# EasyEDA schematic 1-Schematic_first pcb.json
TITLE: Sheet_1; REV: 1.0; Date: 2023-10-01; Sheet: 1/1; Drawn By: Muhammad Hamza; Company: Your Company
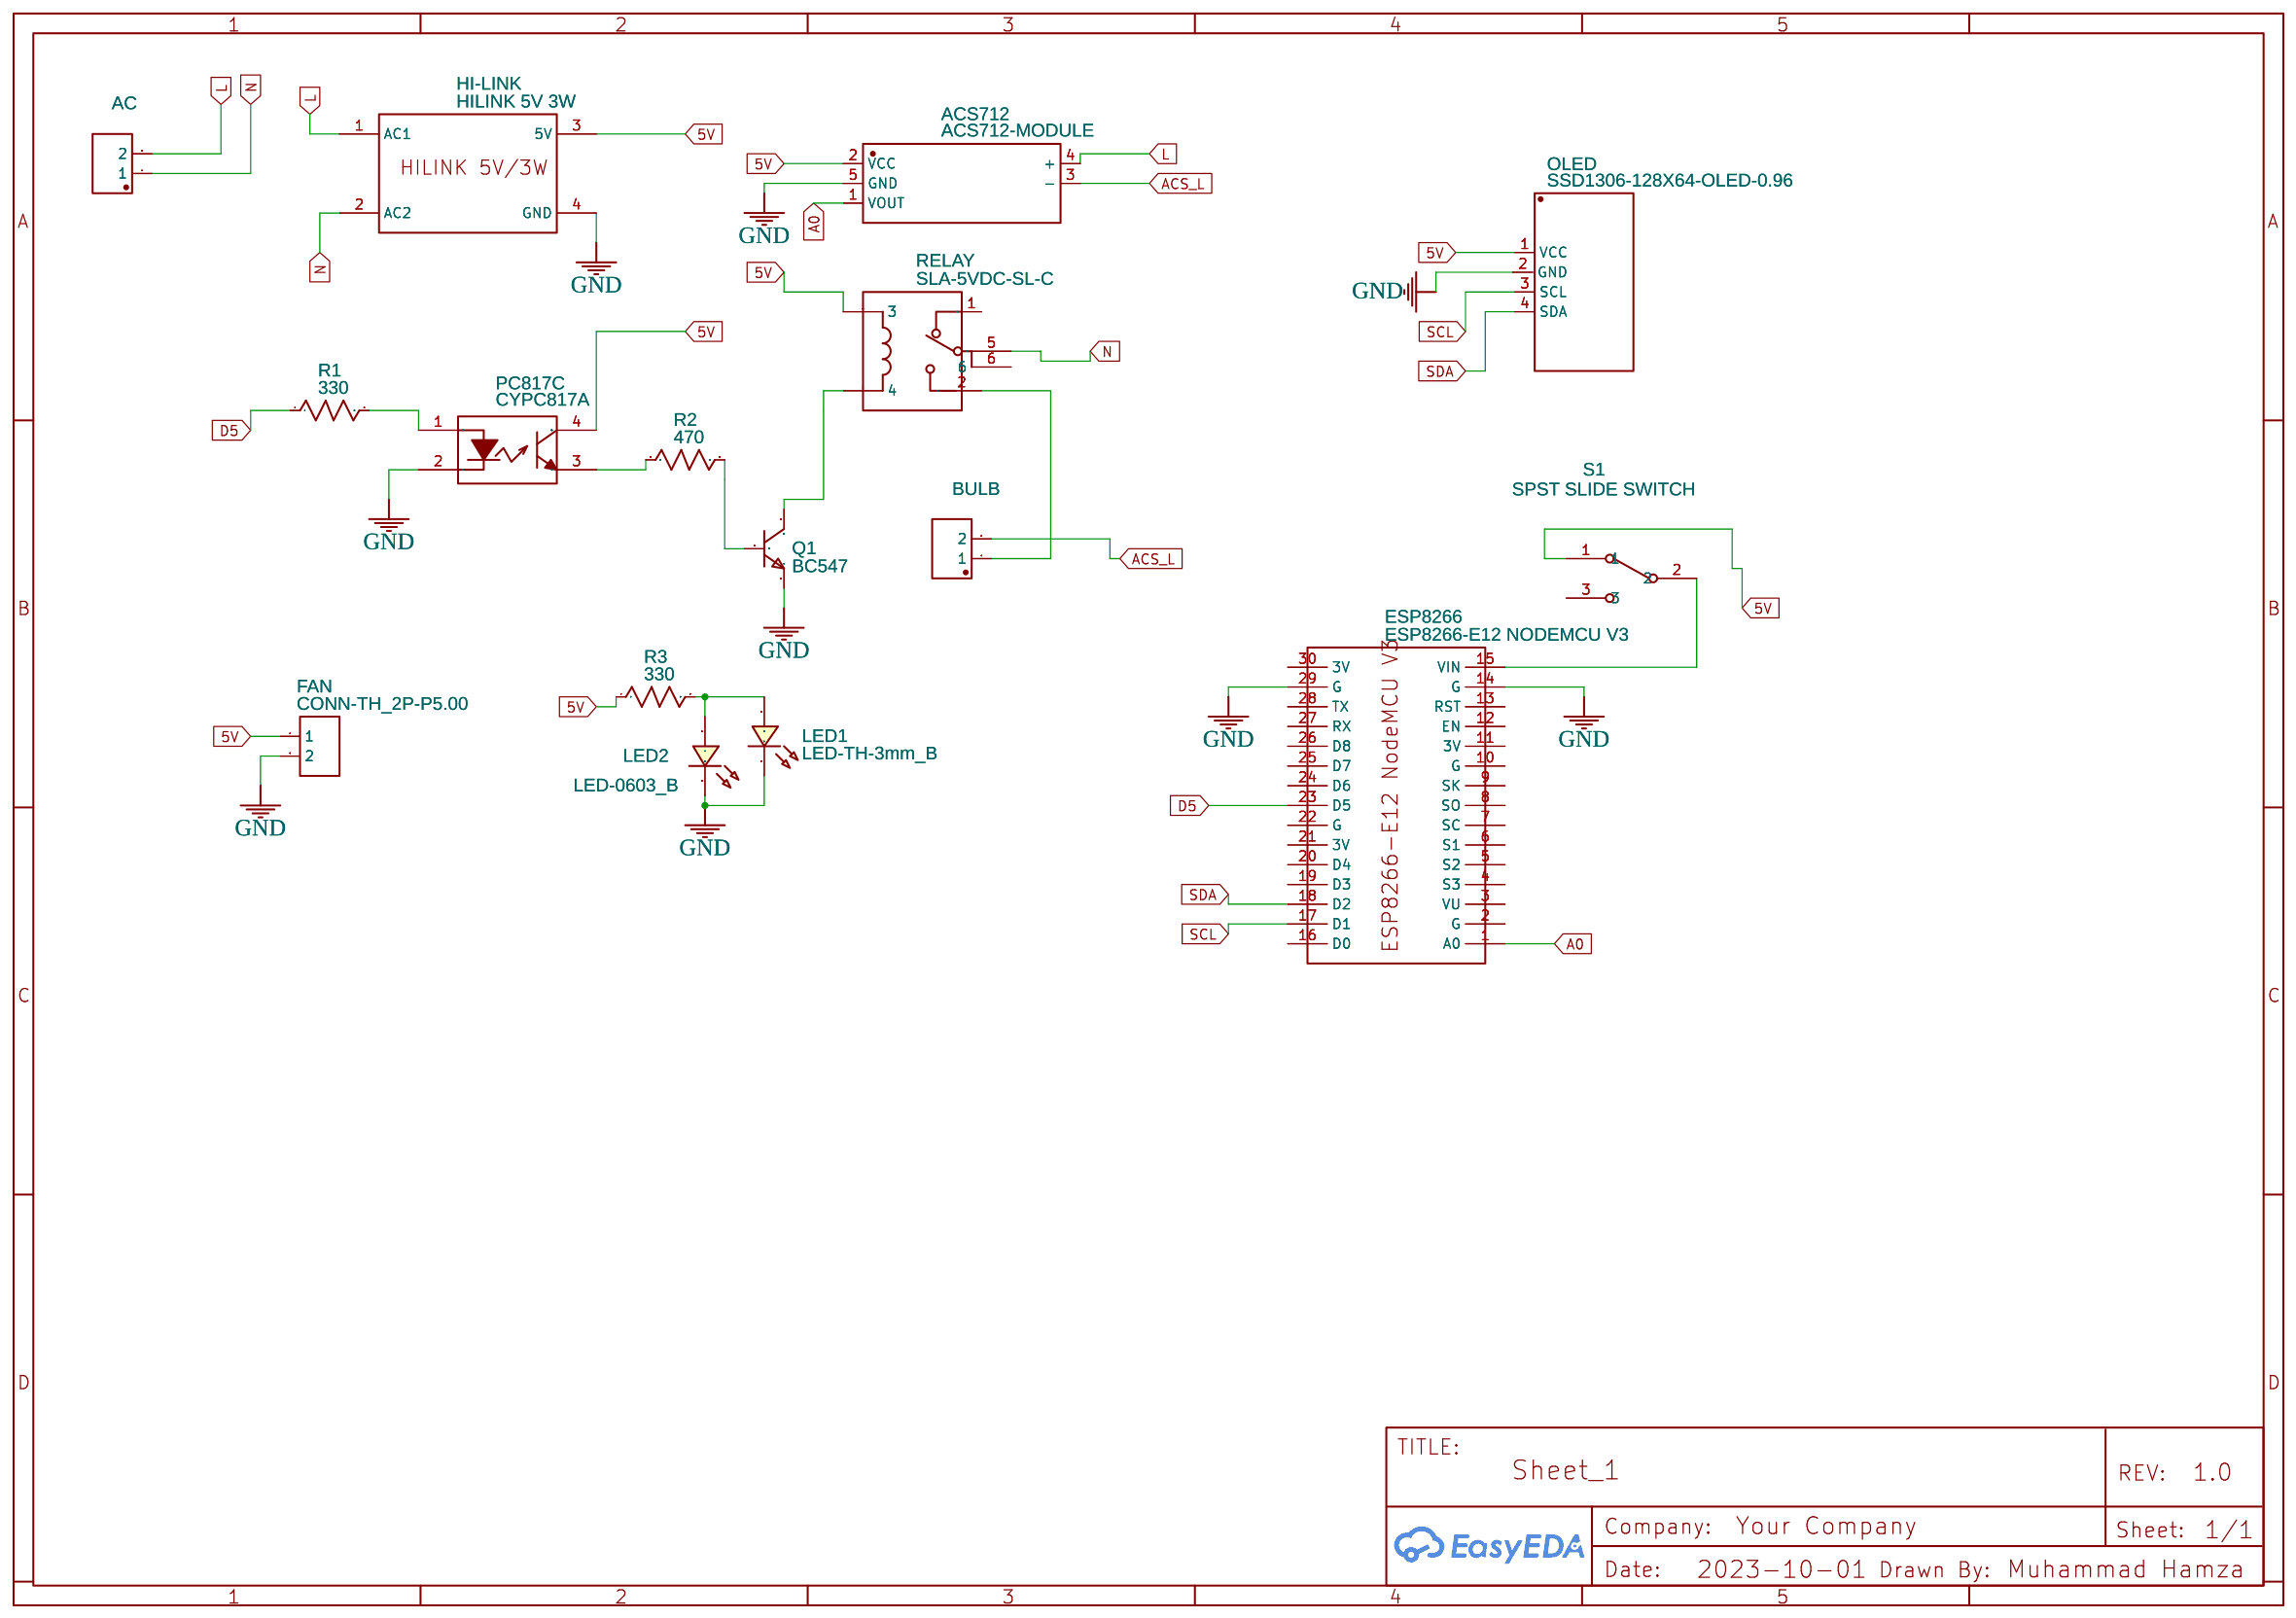
[diagram p0: schematic sheet]

## Parts
AC  NO  [‎YK4410203000G, 2PIN 9.5MM TERMINAL BLOCK]
ACS712  ACS712-MODULE  [ACS712-MODULE]
BULB  NO  [‎YK4410203000G, 2PIN 9.5MM TERMINAL BLOCK]
ESP8266  ESP8266-E12 NODEMCU V3  [ESP8266-E12-NODEMCU-V3]
FAN  CONN-TH_2P-P5.00  [CONN-TH_2P-P5.00]
HI-LINK  HILINK 5V 3W  [HILINK 5V]
LED1  LED-TH-3mm_B  [LED-TH_BD3.0_BLUE]
LED2  LED-0603_B  [LED0603_BLUE]
OLED  SSD1306-128X64-OLED-0.96  [SSD1306]
PC817C  CYPC817A  [DIP-4_L6.4-W4.6-P2.54-LS7.6-BL]
Q1  BC547  [BC547]
R1  330  [R_AXIAL-0.4]
R2  470  [R_AXIAL-0.4]
R3  330  [R_AXIAL-0.4]
RELAY  SLA-5VDC-SL-C  [RELAY-TH_SLA-XXVDC-SL-C]
S1  SPST SLIDE SWITCH  [SPST SLIDE SWITCH]

## Library data of the parts
AC BULB = Terminal_Block_9.5mm_2P: Manufacturer: n/a; Manufacturer Part: n/a; Supplier Part: n/a; link: n/a; Contributor: chethans453
ACS712 = ACS712-MODULE: Manufacturer Part: DIY PCB S09; Supplier Part: undefined; Contributor: matyasma
ESP8266 = ESP8266-E12 NODEMCU V3: Contributor: sigmur
FAN = CONN-TH_2P-P5.00: Supplier: LCSC; Contributor: LCEDA_Lib
HI-LINK = HILINK 5V 3W: Contributor: bruno.cadet
LED1 = LED-TH-3mm_B: Manufacturer: EVERLIGHT(台湾亿光); Manufacturer Part: 204-10SUBC/S400-A4; Supplier Part: C86881; Supplier: LCSC; Contributor: LCEDA_Lib
LED2 = LED-0603_B: Manufacturer: EVERLIGHT(台湾亿光); Manufacturer Part: 19-217/BHC-ZL1M2RY/3T; Supplier Part: C72041; Supplier: LCSC; Contributor: LCEDA_01
OLED = SSD1306-128X64-OLED-0.96: sourceId: wICUcuL3l
PC817C = CYPC817A: Supplier: LCSC; Supplier Part: C7589065; Manufacturer: OCIC(卓睿科); Contributor: lcsc; link: https://lcsc.com/eda_search?q=C7589065&%26type=1&ref=editor
Q1 = BC547: Supplier: LCSC; Supplier Part: C258144; Manufacturer: ON Semicon; Manufacturer Part: BC547BTA; Contributor: DannyHallo
R1-R3 = R_AXIAL-0.4_US: Contributor: LCEDA_Lib
RELAY = SLA-5VDC-SL-C: Contributor: LCSC; Supplier: LCSC; Supplier Part: C688870; Manufacturer: 松乐; JLCPCB Part Class: Extended Part; link: https://lcsc.com/eda_search?q=C688870&%26type=1&ref=editor
S1 = SPST SLIDE SWITCH: Contributor: tyson.s.cabral

## Nets
5V: ACS712.2(VCC) FAN.1 HI-LINK.3(5V) OLED.1(VCC) PC817C.4(COL) R3.1 RELAY.3 S1.1
GND: ACS712.5(GND) ESP8266.14(G) ESP8266.29(G) FAN.2 HI-LINK.4(GND) LED1.2 LED2.2 OLED.2(GND) PC817C.2(CAT) Q1.3(E)
A0: ACS712.1(VOUT) ESP8266.1(A0)
ACS_L: ACS712.3(-) BULB.2
D5: ESP8266.23(D5) R1.1
L: AC.2 ACS712.4(+) HI-LINK.1(AC1)
N: AC.1 HI-LINK.2(AC2) RELAY.5
SCL: ESP8266.17(D1) OLED.3(SCL)
SDA: ESP8266.18(D2) OLED.4(SDA)
Net-(BULB-1): BULB.1 RELAY.2
Net-(ESP8266-15): ESP8266.15(VIN) S1.2
Net-(LED1-1): LED1.1 LED2.1 R3.2
Net-(PC817C-1): PC817C.1(AN) R1.2
Net-(PC817C-3): PC817C.3(EM) R2.1
Net-(Q1-1): Q1.1(C) RELAY.4
Net-(Q1-2): Q1.2(B) R2.2

Not connected (* = marked no-connect by the designer): ESP8266 2(G) 3(VU) 4(S3) 5(S2) 6(S1) 7(SC) 8(SO) 9(SK) 10(G) 11(3V) 12(EN) 13(RST) 16(D0) 19(D3) 20(D4) 21(3V) 22(G) 24(D6) 25(D7) 26(D8) 27(RX) 28(TX) 30(3V); RELAY 1 6; S1 3
